# Altium schematic sheet SIM900.SchDoc
size A3
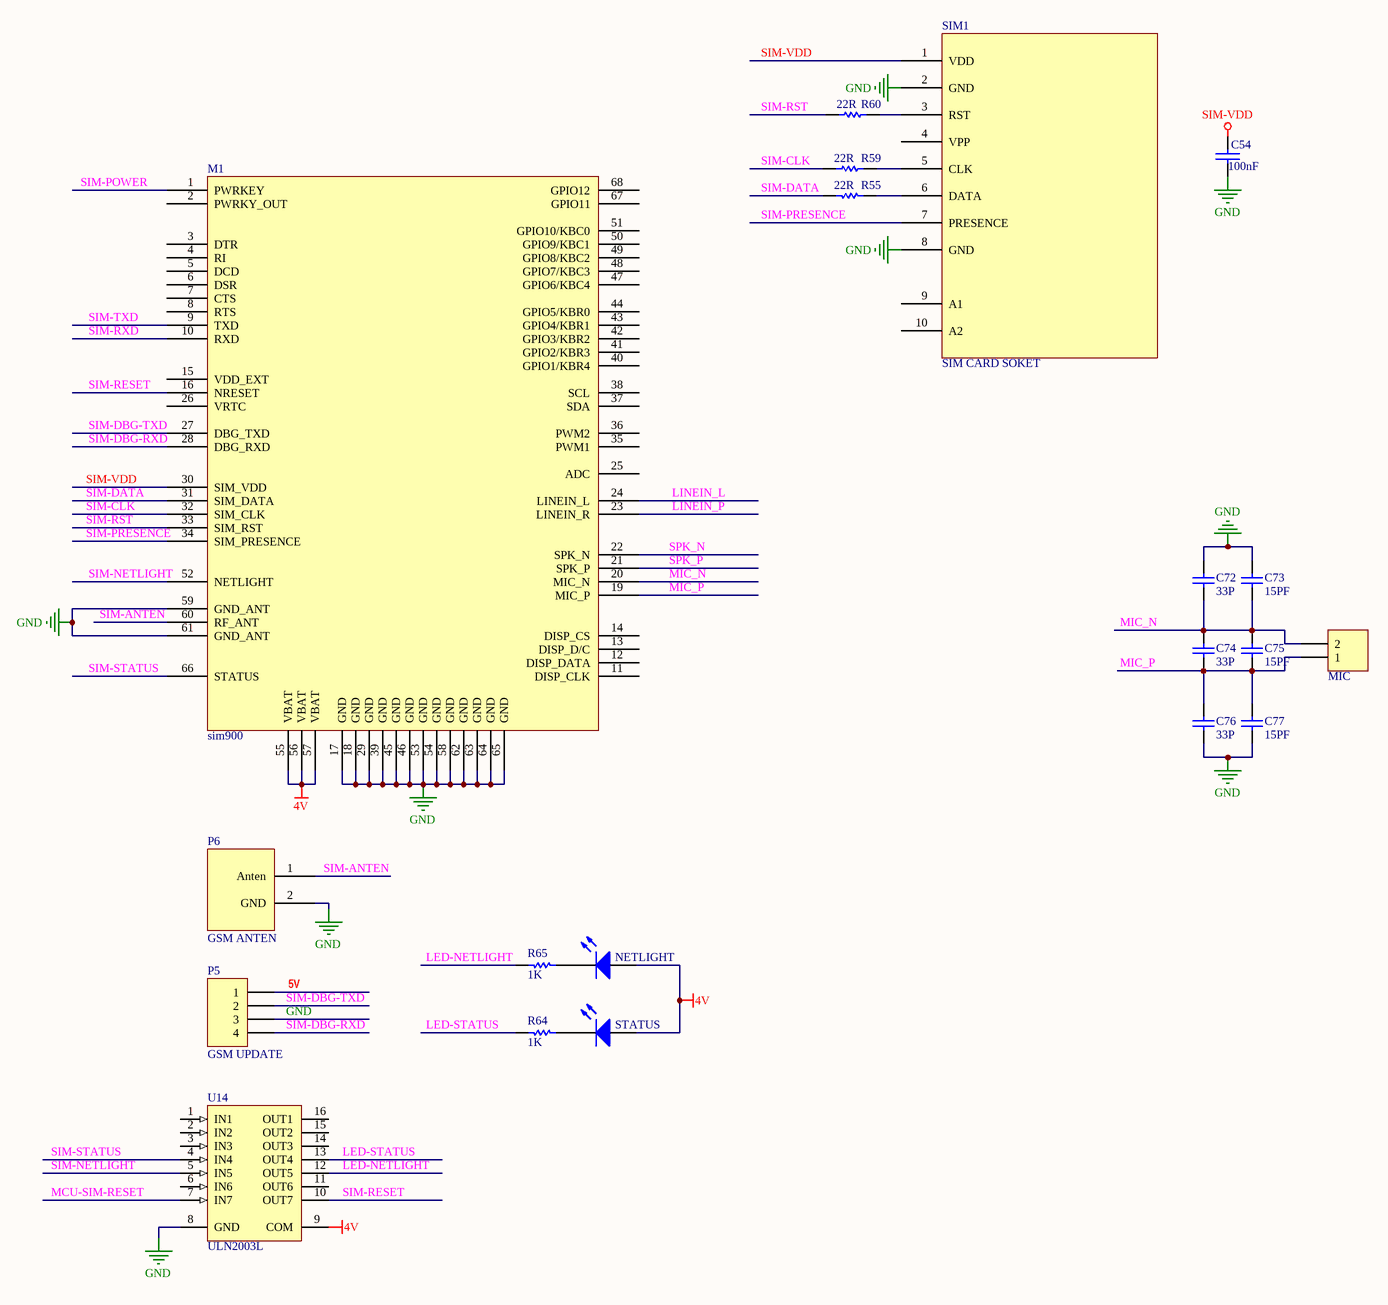
[diagram p0: SIM900.SchDoc]

## Parts
C54  100nF  [0805C]
C72  33P  [0805C]
C73  15PF  [0805C]
C74  33P  [0805C]
C75  15PF  [0805C]
C76  33P  [0805C]
C77  15PF  [0805C]
M1  sim900  [sim900]
MIC  CON 2PIN  [Microphone]  (value not drawn)
NETLIGHT  LED  [0805D]  (value not drawn)
P5  Publisher: GSM UPDATE  [CON_4PIN]  (hidden comment: CON 4)
P6  GSM ANTEN  [anten-jack]
R55  22R  [0805]
R59  22R  [0805]
R60  22R  [0805]
R64  1K  [0805]
R65  1K  [0805]
SIM1  SIM CARD SOKET  [SIM HOLDER 2]
STATUS  LED  [0805D]  (value not drawn)
U14  ULN2003L  [L16_N]

## Nets
4V: M1.55(VBAT) M1.56(VBAT) M1.57(VBAT) NETLIGHT.1(A) STATUS.1(A) U14.9(COM)
GND: C54.2 C72.1 C73.1 C76.2 C77.2 M1.17(GND) M1.18(GND) M1.29(GND) M1.39(GND) M1.45(GND) M1.46(GND) M1.53(GND) M1.54(GND) M1.58(GND) M1.59(GND_ANT) M1.61(GND_ANT) M1.62(GND) M1.63(GND) M1.64(GND) M1.65(GND) P5.3 P6.2(GND) SIM1.2(GND) SIM1.8(GND) U14.8(GND)
SIM-VDD: C54.1 M1.30(SIM_VDD) SIM1.1(VDD)
5V: P5.1
LED-NETLIGHT: R65.2 U14.12(OUT5)
LED-STATUS: R64.2 U14.13(OUT4)
LINEIN_L: M1.24(LINEIN_L)
LINEIN_P: M1.23(LINEIN_R)
MCU-SIM-RESET: U14.7(IN7)
MIC_N: C72.2 C73.2 C74.1 C75.1 M1.20(MIC_N) MIC.2
MIC_P: C74.2 C75.2 C76.1 C77.1 M1.19(MIC_P) MIC.1
SIM-ANTEN: M1.60(RF_ANT) P6.1(Anten)
SIM-CLK: M1.32(SIM_CLK) R59.1
SIM-DATA: M1.31(SIM_DATA) R55.2
SIM-DBG-RXD: M1.28(DBG_RXD) P5.4
SIM-DBG-TXD: M1.27(DBG_TXD) P5.2
SIM-NETLIGHT: M1.52(NETLIGHT) U14.5(IN5)
SIM-POWER: M1.1(PWRKEY)
SIM-PRESENCE: M1.34(SIM_PRESENCE) SIM1.7(PRESENCE)
SIM-RESET: M1.16(NRESET) U14.10(OUT7)
SIM-RST: M1.33(SIM_RST) R60.1
SIM-RXD: M1.10(RXD)
SIM-STATUS: M1.66(STATUS) U14.4(IN4)
SIM-TXD: M1.9(TXD)
SPK_N: M1.22(SPK_N)
SPK_P: M1.21(SPK_P)
NetNETLIGHT_2: NETLIGHT.2(K) R65.1
NetR55_1: R55.1 SIM1.6(DATA)
NetR59_2: R59.2 SIM1.5(CLK)
NetR60_2: R60.2 SIM1.3(RST)
NetR64_1: R64.1 STATUS.2(K)

Not connected (* = marked no-connect by the designer): M1 2(PWRKY_OUT) 3(DTR) 4(RI) 5(DCD) 6(DSR) 7(CTS) 8(RTS) 11(DISP_CLK) 12(DISP_DATA) 13(DISP_D/C) 14(DISP_CS) 15(VDD_EXT) 25(ADC) 26(VRTC) 35(PWM1) 36(PWM2) 37(SDA) 38(SCL) 40(GPIO1/KBR4) 41(GPIO2/KBR3) 42(GPIO3/KBR2) 43(GPIO4/KBR1) 44(GPIO5/KBR0) 47(GPIO6/KBC4) 48(GPIO7/KBC3) 49(GPIO8/KBC2) 50(GPIO9/KBC1) 51(GPIO10/KBC0) 67(GPIO11) 68(GPIO12); SIM1 4(VPP) 9(A1) 10(A2); U14 1(IN1) 2(IN2) 3(IN3) 6(IN6) 11(OUT6) 14(OUT3) 15(OUT2) 16(OUT1)

## Library data of the parts
C54 = CAP
C72 C74 = Cap: Capacitor; Value: 33pF; Published: 8-Jun-2000; Revision: July-2002: Re-released for DXP Platform.; Publisher: Altium Limited
C73 C75 C77 = Cap: Capacitor; Published: 8-Jun-2000; Revision: July-2002: Re-released for DXP Platform.; Publisher: Altium Limited
C76 = Cap: Capacitor; Value: 100pF; Published: 8-Jun-2000; Revision: July-2002: Re-released for DXP Platform.; Publisher: Altium Limited
MIC = Header 2H: Header, 2-Pin, Right Angle; LatestRevisionDate: 17-Jul-2002; LatestRevisionNote: Re-released for DXP Platform.; Publisher: Altium Limited
NETLIGHT STATUS = LED0: Typical INFRARED GaAs LED; Published: 8-Jun-2000; LatestRevisionDate: 08-Jul-2005; LatestRevisionNote: Mech Layer 1 removed.; PackageReference: LED-0; Publisher: Altium Limited
P5 = Header 4H: Header, 4-Pin, Right Angle; LatestRevisionDate: 17-Jul-2002; LatestRevisionNote: Re-released for DXP Platform.
P6 = Anten
R55 R59 R60 = Res1: Resistor; Value: 1K; Published: 8-Jun-2000; Revision: July-2002: Re-released for DXP Platform.; Publisher: Altium Limited
R64 R65 = Res1: Resistor; Published: 8-Jun-2000; LatestRevisionDate: 17-Jul-2002; LatestRevisionNote: Re-released for DXP Platform.; PackageReference: AXIAL-0.3; Publisher: Altium Limited; Value: 1K
SIM1 = SIM HOLDER
U14 = ULN2003L: High-Voltage, High-Current Darlington Array; Published: 13-Oct-2000; LatestRevisionDate: 13-Apr-2006; LatestRevisionNote: IPC-7351 Footprint Added.; DatasheetVersion: 1998; PackageReference: L16; Publisher: Altium Limited; PackageDescription: 16-Pin Small Outline Integrated Circuit 1.27 mm Pitch; Code_JEDEC: MS-012-AC; Code_IPC: SOIC127P600-16; ComponentLink1Description: Manufacturer Link; ComponentLink1URL: http://www.allegromicro.com/